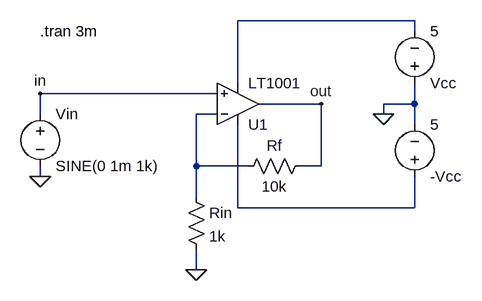
[diagram p0: schematic non_inverting_amp.asc]
non_inverting_amp.asc, the LTspice schematic file:
Version 4.1
SHEET 1 880 680
WIRE 448 32 176 32
WIRE 448 48 448 32
WIRE 176 128 176 32
WIRE 144 144 -128 144
WIRE 304 160 208 160
WIRE 448 160 448 128
WIRE 448 160 400 160
WIRE -128 176 -128 144
WIRE 144 176 112 176
WIRE 400 176 400 160
WIRE 448 192 448 160
WIRE 112 256 112 176
WIRE 192 256 112 256
WIRE 304 256 304 160
WIRE 304 256 272 256
WIRE -128 272 -128 256
WIRE 112 304 112 256
WIRE 176 320 176 192
WIRE 448 320 448 272
WIRE 448 320 176 320
WIRE 112 416 112 384
FLAG 112 416 0
FLAG -128 272 0
FLAG 400 176 0
FLAG -128 144 in
FLAG 304 160 out
SYMBOL voltage -128 160 R0
WINDOW 123 0 0 Left 0
WINDOW 39 0 0 Left 0
SYMATTR InstName Vin
SYMATTR Value SINE(0 1m 1k)
SYMBOL voltage 448 144 M180
WINDOW 123 0 0 Left 0
WINDOW 39 0 0 Left 0
SYMATTR InstName Vcc
SYMATTR Value 5
SYMBOL voltage 448 288 M180
WINDOW 123 0 0 Left 0
WINDOW 39 0 0 Left 0
SYMATTR InstName -Vcc
SYMATTR Value 5
SYMBOL OpAmps\\LT1001 176 224 M180
SYMATTR InstName U1
SYMBOL res 96 288 R0
SYMATTR InstName Rin
SYMATTR Value 1k
SYMBOL res 288 240 R90
WINDOW 0 0 56 VBottom 2
WINDOW 3 32 56 VTop 2
SYMATTR InstName Rf
SYMATTR Value 10k
TEXT -128 48 Left 2 !.tran 3m

The netlist it stands for:
* non_inverting_amp.asc
Vin in 0 SINE(0 1m 1k)
Vcc 0 N001 5
V§-Vcc N003 0 5
X§U1 in N002 N003 N001 out LT1001  ; pins In+ In- V+ V- OUT
Rin N002 0 1k
Rf out N002 10k
.tran 3m
.lib LTC.lib
.backanno
.end